# EAGLE design RJ12Breakout (EAGLE 6.2)
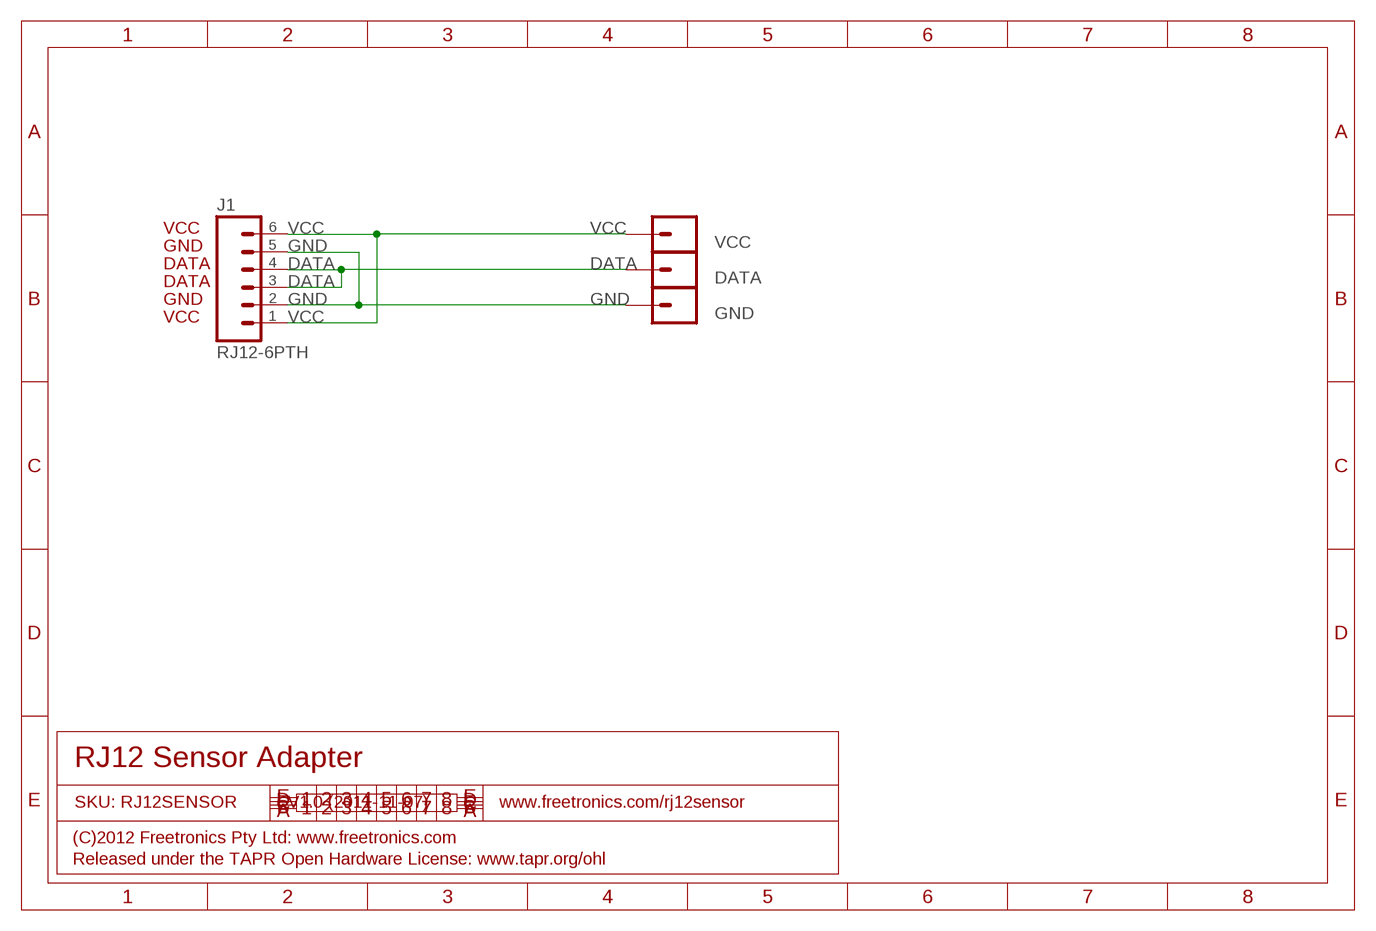
[diagram p0: schematic, sheet 1]

## Parts
DATA  M01PTH  [1X01]
GND  M01PTH  [1X01]
J1  RJ12-6PTH  [RJ12-6]
VCC  M01PTH  [1X01]

## Nets
DATA: DATA.1 J1.3 J1.4
GND: GND.1 J1.2 J1.5
VCC: J1.1 J1.6 VCC.1

## Notes on the sheet
- VCC
- GND
- DATA
- DATA
- GND
- VCC
- RJ12 Sensor Adapter
- SKU: RJ12SENSOR | V1.0 (2011-11-07) | www.freetronics.com/rj12sensor
- (C)2012 Freetronics Pty Ltd: www.freetronics.com
- Released under the TAPR Open Hardware License: www.tapr.org/ohl

## Library data of the parts
DATA GND VCC = freetronics-master-v1:M01: Header 1 Standard 1-pin 0.1" header. Use with straight break away headers (SKU : PRT-00116), right angle break away headers (PRT-00553), swiss pins (PRT-00743), machine pins (PRT-00117), and female headers (PRT-00115).
J1 = freetronics-jon:RJ12-6

## Board
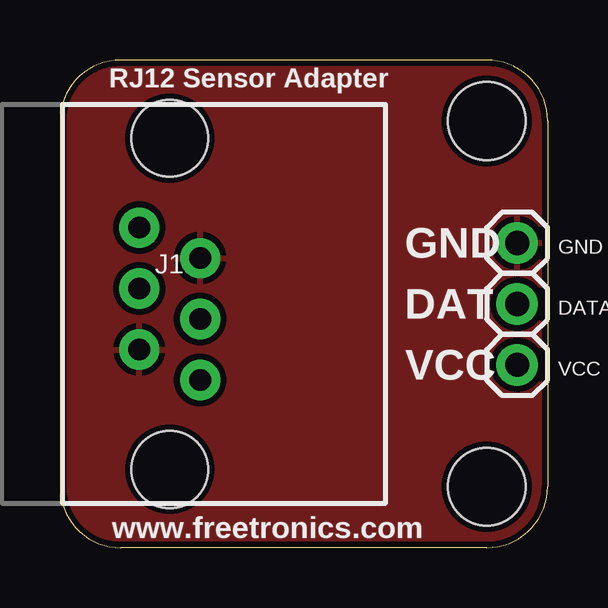
[diagram p1: board, top side]
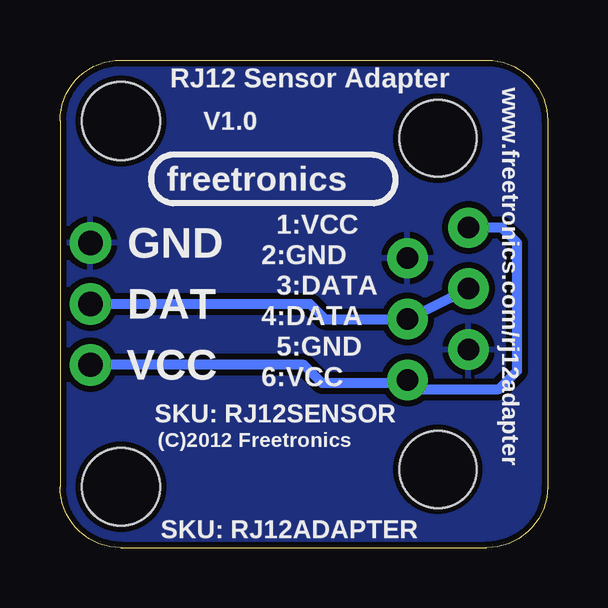
[diagram p2: board, bottom side, seen from below]

Size 20.32 x 20.32 mm. Coordinates in mm from the lower left corner, seen from the top.
Outline: 2.54,20.32 arc90 0,17.78 0,2.54 arc90 2.54,0 17.78,0 arc90 20.32,2.54 20.32,17.78 arc90 17.78,20.32 2.54,20.32
Copper layers (1*16): Top 0.035mm / dielectric 1.5mm / Bottom 0.035mm
Design rules: minimum track width 8mil, minimum drill 15mil, track to track 10mil, track to pad 10mil, pad to pad 10mil, via to via 10mil, smd to smd 8mil, copper to edge 10mil, drill to drill 8mil, minimum pad ring 14mil, minimum via ring 8mil, stop-mask expansion 4mil, vias tented up to drill 25mil, thermal gap 10mil
Holes 3.25 mm at 17.78,17.78 17.78,2.54

### Footprints (pad centres in the part's own frame; a part is rotated, then mirrored left to right if it is on the bottom)
1X01 = drill 1.016: 1 0,0
RJ12-6 = drill 0.9 pad 1.676: 1 -3.175,-1.27; 2 -1.905,1.27; 3 -0.635,-1.27; 4 0.635,1.27; 5 1.905,-1.27; 6 3.175,1.27 | hole 3.2: -6.9,0; 6.9,0

### Placement (x,y rotation side)
DATA  19.05,10.16 270 top
GND  19.05,12.7 270 top
J1  4.57,10.16 270 top
VCC  19.05,7.62 270 top

### Tracks (layer width: path | path; a pad name or v marks a point on that pad's centre or on a via)
DATA
  Bottom 0.406: J1.3 J1.4 9.27,9.53 9.91,10.16 DATA.1
GND
  pour Bottom: 20.32,17.78 arc90 17.78,20.32 2.54,20.32 arc90 0,17.78 0,2.54 arc90 2.54,0 17.78,0 arc90 20.32,2.54
  pour Top: 17.78,20.32 2.54,20.32 arc90 0,17.78 0,2.54 arc90 2.54,0 17.78,0 arc90 20.32,2.54 20.32,17.78 arc90
VCC
  Bottom 0.406: 5.71,6.86 5.46,6.6 2.03,6.6 1.27,7.37 1.27,12.7 1.91,13.34 J1.1 | J1.6 5.71,6.86 | 5.71,6.86 9.4,6.86 10.16,7.62 VCC.1

### Text on the board
tPlace: RJ12 Sensor Adapter | GND | DAT | VCC | www.freetronics.com
bPlace: www.freetronics.com/rj12adapter | RJ12 Sensor Adapter | V1.0 | freetronics | 1:VCC | 2:GND | GND | 3:DATA | DAT | 4:DATA | 5:GND | 6:VCC | VCC | SKU: RJ12SENSOR | (C)2012 Freetronics | SKU: RJ12ADAPTER